# EAGLE design clock (EAGLE 9.6.2)
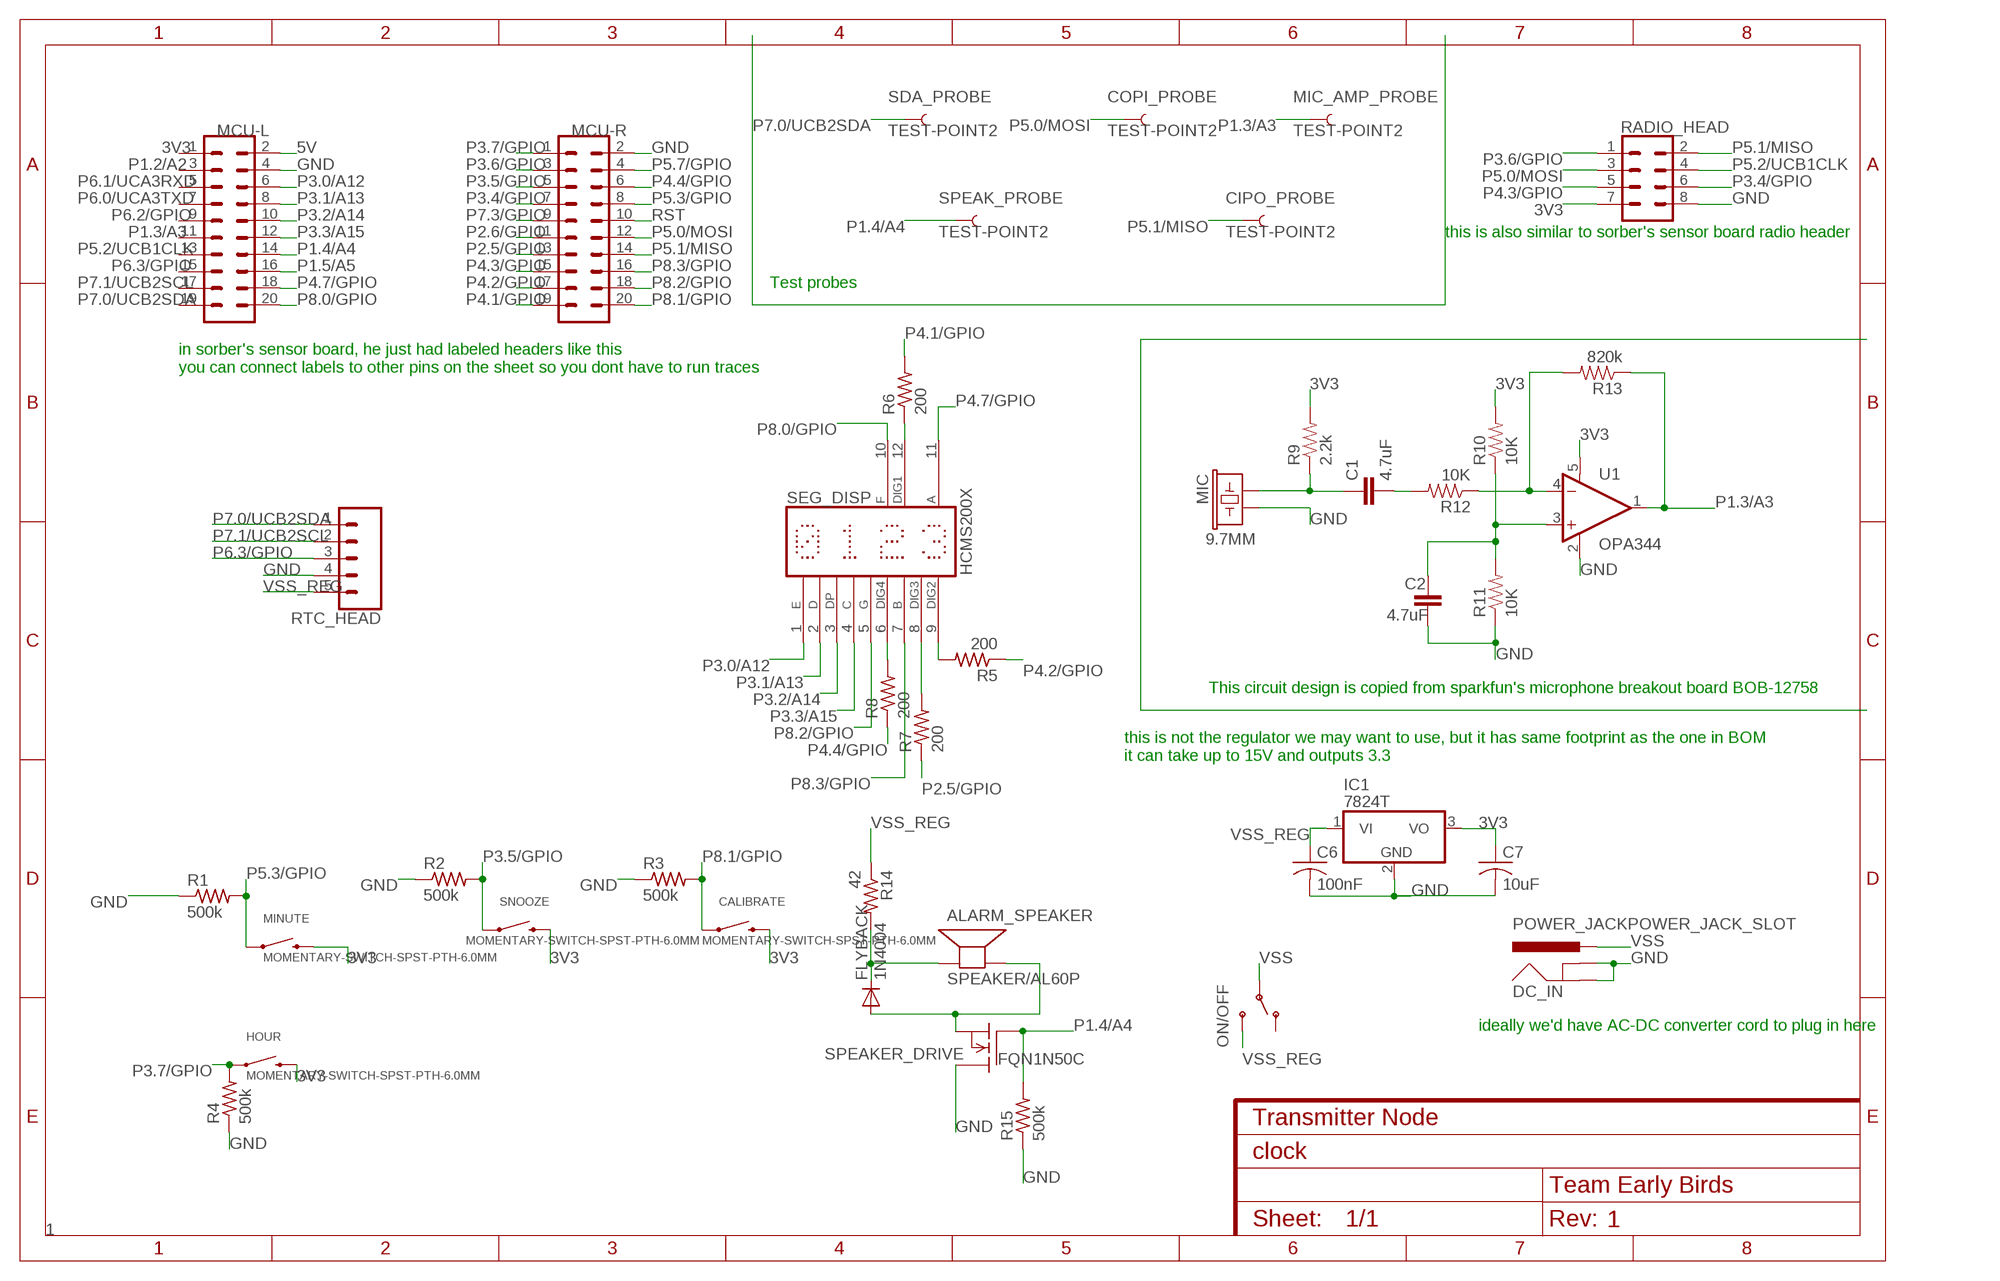
[diagram p0: schematic, sheet 1]
FRAME1 (FRAME-A4L): CNAME: Transmitter Node; CREVISION: 1; DESIGNER: Team Early Birds; REV: 1

## Parts
ALARM_SPEAKER  SPEAKER/AL60P  [AL60P]
C1  4.7uF  4.7UF-6.3V-10%(0603)0603  [0603-CAP]
C2  4.7uF  4.7UF-6.3V-10%(0603)0603  [0603-CAP]
C6  100nF  C-USC0805  [C0805]
C7  10uF  C-USC0805  [C0805]
CALIBRATE  MOMENTARY-SWITCH-SPST-PTH-6.0MM  [TACTILE_SWITCH_PTH_6.0MM]
CIPO_PROBE  TEST-POINT2  [PAD.02X.02]
COPI_PROBE  TEST-POINT2  [PAD.02X.02]
DC_IN  POWER_JACKPOWER_JACK_SLOT  [POWER_JACK_PTH_SLOT]
FLYBACK  1N4004  [DO41-10]
HOUR  MOMENTARY-SWITCH-SPST-PTH-6.0MM  [TACTILE_SWITCH_PTH_6.0MM]
IC1  7824T  [TO220H]
MCU-L  CONN_10X2  [2X10]
MCU-R  CONN_10X2  [2X10]
MIC  9.7MM  MIC9.7MM  [MIC-9.7MM]
MIC_AMP_PROBE  TEST-POINT2  [PAD.02X.02]
MINUTE  MOMENTARY-SWITCH-SPST-PTH-6.0MM  [TACTILE_SWITCH_PTH_6.0MM]
ON/OFF  SWITCH-SPDTSMD  [SWITCH_SPDT_SMD]
R1  500k  R-US_0204/5  [0204/5]
R2  500k  R-US_0204/5  [0204/5]
R3  500k  R-US_0204/5  [0204/5]
R4  500k  R-US_0204/5  [0204/5]
R5  200  R-US_0204/7  [0204/7]
R6  200  R-US_0204/7  [0204/7]
R7  200  R-US_0204/7  [0204/7]
R8  200  R-US_0204/7  [0204/7]
R9  2.2k  2.2KOHM-1/10W-1%(0603)  [0603-RES]
R10  10K  10KOHM-1/10W-1%(0603)0603  [0603-RES]
R11  10K  10KOHM-1/10W-1%(0603)0603  [0603-RES]
R12  10K  10KOHM-1/10W-1%(0603)0603  [0603-RES]
R13  820k  820KOHM-1/10W-1%(0603)  [0603-RES]
R14  42  R-US_0204/7  [0204/7]
R15  500k  R-US_0204/7  [0204/7]
RADIO_HEAD  CONN_04X2  [2X4]
RTC_HEAD  CONN_05LOCK  [1X05_LOCK]
SDA_PROBE  TEST-POINT2  [PAD.02X.02]
SEG_DISP  HCMS200X  [HCMS200X]
SNOOZE  MOMENTARY-SWITCH-SPST-PTH-6.0MM  [TACTILE_SWITCH_PTH_6.0MM]
SPEAK_PROBE  TEST-POINT2  [PAD.02X.02]
SPEAKER_DRIVE  FQN1N50C  [TO92]
U1  OPA344  [SOT23-5]

## Nets
3V3: C7.1 CALIBRATE.3 HOUR.3 IC1.3(VO) MCU-L.1 MINUTE.3 R9.2 R10.2 RADIO_HEAD.7 SNOOZE.3 U1.5(V+)
5V: MCU-L.2
GND: C2.2 C6.2 C7.2 DC_IN.GND DC_IN.GNDBREAK IC1.2(GND) MCU-L.4 MCU-R.2 MIC.2 R1.1 R2.1 R3.1 R4.1 R11.1 R15.1 RADIO_HEAD.8 RTC_HEAD.4 SPEAKER_DRIVE.2(D) U1.2(V-)
MIC_TEST: C1.1 MIC.1 R9.1
N$1: R8.2 SEG_DISP.6(I-CO)
N$3: R7.2 SEG_DISP.8(VB)
N$4: R5.2 SEG_DISP.9(VDD)
N$5: R6.1 SEG_DISP.12(IN)
N$6: R12.1 R13.2 U1.4(-IN)
N$7: C1.2 R12.2
N$8: C2.1 R10.1 R11.2 U1.3(+IN)
N$10: ALARM_SPEAKER.2(-) FLYBACK.A SPEAKER_DRIVE.3(S)
N$11: ALARM_SPEAKER.1(+) FLYBACK.C R14.2
P1.2/A2: MCU-L.3
P1.3/A3: MCU-L.11 MIC_AMP_PROBE.1 R13.1 U1.1(OUT)
P1.4/A4: MCU-L.14 R15.2 SPEAK_PROBE.1 SPEAKER_DRIVE.1(G)
P1.5/A5: MCU-L.16
P2.5/GPIO: MCU-R.13 R7.1
P2.6/GPIO: MCU-R.11
P3.0/A12: MCU-L.6 SEG_DISP.1(COL1)
P3.1/A13: MCU-L.8 SEG_DISP.2(COL2)
P3.2/A14: MCU-L.10 SEG_DISP.3(COL3)
P3.3/A15: MCU-L.12 SEG_DISP.4(COL4)
P3.4/GPIO: MCU-R.7 RADIO_HEAD.6
P3.5/GPIO: MCU-R.5 R2.2 SNOOZE.1
P3.6/GPIO: MCU-R.3 RADIO_HEAD.1
P3.7/GPIO: HOUR.1 MCU-R.1 R4.2
P4.1/GPIO: MCU-R.19 R6.2
P4.2/GPIO: MCU-R.17 R5.1
P4.3/GPIO: MCU-R.15 RADIO_HEAD.5
P4.4/GPIO: MCU-R.6 R8.1
P4.7/GPIO: MCU-L.18 SEG_DISP.11(GND)
P5.0/MOSI: COPI_PROBE.1 MCU-R.12 RADIO_HEAD.3
P5.1/MISO: CIPO_PROBE.1 MCU-R.14 RADIO_HEAD.2
P5.2/UCB1CLK: MCU-L.13 RADIO_HEAD.4
P5.3/GPIO: MCU-R.8 MINUTE.1 R1.2
P5.7/GPIO: MCU-R.4
P6.0/UCA3TXD: MCU-L.7
P6.1/UCA3RXD: MCU-L.5
P6.2/GPIO: MCU-L.9
P6.3/GPIO: MCU-L.15 RTC_HEAD.3
P7.0/UCB2SDA: MCU-L.19 RTC_HEAD.1 SDA_PROBE.1
P7.1/UCB2SCL: MCU-L.17 RTC_HEAD.2
P7.3/GPIO: MCU-R.9
P8.0/GPIO: MCU-L.20 SEG_DISP.10(CLK)
P8.1/GPIO: CALIBRATE.1 MCU-R.20 R3.2
P8.2/GPIO: MCU-R.18 SEG_DISP.5(COL5)
P8.3/GPIO: MCU-R.16 SEG_DISP.7(OUT)
RST: MCU-R.10
VSS: DC_IN.PWR ON/OFF.2(P)
VSS_REG: C6.1 IC1.1(VI) ON/OFF.3(S) R14.1 RTC_HEAD.5
Unconnected: ON/OFF.1(O)

## Notes on the sheet
- this is also similar to sorber's sensor board radio header
- Test probes
- in sorber's sensor board, he just had labeled headers like this
  you can connect labels to other pins on the sheet so you dont have to run traces
- This circuit design is copied from sparkfun's microphone breakout board BOB-12758
- this is not the regulator we may want to use, but it has same footprint as the one in BOM
  it can take up to 15V and outputs 3.3
- ideally we'd have AC-DC converter cord to plug in here

## Library data of the parts
ALARM_SPEAKER = adafruit:SPEAKER: SPEAKER Source: Buerklin Added PS12 (for part # PS1240 piezo) http://www.ladyada.net/library/pcb/eaglelibrary.html
C1 C2 = SparkFun-Capacitors:4.7UF-6.3V-10%(0603): CAP-08280; PROD_ID: CAP-08280
C6 C7 = adafruit:C-US: CAPACITOR, American symbol
CALIBRATE HOUR MINUTE SNOOZE = SparkFun-Switches:MOMENTARY-SWITCH-SPST: Momentary Switch (Pushbutton) - SPST Normally-open (NO) SPST momentary switches (buttons, pushbuttons). Variants PTH-12MM - 12mm square, through-hole Momentary Pushbutton Switch - 12mm Square <https://www.sparkfun.com/products/9190> (COM-09190) PTH-6.0MM, PTH-6.0MM-KIT - 6.0mm square, through-hole Mini Pushbutton Switch <https://www.sparkfun.com/products/97> (COM-00097) KIT package intended for soldering kit's - only one side of pads' copper is exposed. PTH-RIGHT-ANGLE-KIT - Right-angle, through-hole Right Angle Tactile Button <https://www.sparkfun.com/products/10791> - Used on SparkFun BigTime Watch Kit <https://www.sparkfun.com/products/11734> SMD-12MM - 12mm square, surface-mount Tactile Button - SMD (12mm) <https://www.sparkfun.com/products/12993> (COM-12993) Used on SparkFun PicoBoard <https://www.sparkfun.com/products/11888> SMD-4.5MM - 4.5mm Square Trackball Switch Used on SparkFun Blackberry Trackballer Breakout <https://www.sparkfun.com/products/13169> SMD-4.6MMX2.8MM - 4.60mm x 2.80mm, surface mount Used on SparkFun SAMD21 Mini Breakout <https://www.sparkfun.com/products/13664> SMD-5.2MM, SMD-5.2-REDUNDANT - 5.2mm square, surface-mount Mini Pushbutton Switch - SMD <https://www.sparkfun.com/products/8720> (COM-08720) Used on Arduino Pro Mini <https://www.sparkfun.com/products/11114> REDUNDANT package connects both switch circuits together SMD-6.0X3.5MM - 6.0 x 3.5mm, surface mount Momentary Reset Switch SMD <https://www.sparkfun.com/products/8229> (COM-08229) SMD-6.2MM-TALL - 6.2mm square, surface mount Tactile Button - SMD (6mm) <https://www.sparkfun.com/products/12992> Used on SparkFun Digital Sandbox <https://www.sparkfun.com/products/12651> SMD-RIGHT-ANGLE - Right-angle, surface mount Used on SparkFun Block for Intel® Edison - Arduino <https://www.sparkfun.com/products/13036>; PROD_ID: SWCH-08441; SF_SKU: COM-00097
CIPO_PROBE COPI_PROBE MIC_AMP_PROBE SDA_PROBE SPEAK_PROBE = SparkFun-Connectors:TEST-POINT: SparkFun Test Points Bare copper test points for troubleshooting or In-Circuit-Testing. These are used by our Production team for verifying production board runs using pogo-pins on test beds. SparkFun Products: SparkFun LSM9DS1 Breakout <https://www.sparkfun.com/products/13284> SparkFun PSOC <https://www.sparkfun.com/products/13714> SparkFun Load Cell Amplifier <https://www.sparkfun.com/products/13879>
DC_IN = SparkFun-Connectors:POWER_JACK: Power Jack Connector This is the standard 5.5mm barrel jack for power. The PTH is the most common, proven, reliable, footprint. The Slot footprint only works if the mill layer is transmitted to the PCB fab house so be warned. Here are the connectors we sell at SparkFun: DC Barrel Power Jack/Connector <https://www.sparkfun.com/products/119> (PRT-00119) DC Barrel Power Jack/Connector (SMD) <https://www.sparkfun.com/products/12748> (PRT-12748) DC Barrel Jack Adapter - Breadboard Compatible <https://www.sparkfun.com/products/10811> (PRT-10811) It is used on this SparkFun product (and many, many others): SparkFun RedBoard - Programmed with Arduino <https://www.sparkfun.com/products/12757> (DEV-12757) Also, if you need a mating power supply or connector, please check these out: Wall Adapter Power Supply - 9VDC 650mA <https://www.sparkfun.com/products/298> (TOL-00298) DC Barrel Jack Adapter - Male <https://www.sparkfun.com/products/10287> (PRT-10287); PROD_ID: CONN-08197
FLYBACK = adafruit:1N4004: DIODE General purpose 1N400x type rectifier (With bigger pads) http://www.ladyada.net/library/pcb/eaglelibrary.html
IC1 = adafruit:78*: Positive VOLTAGE REGULATOR Added bigger pads to the TO-92 package
MCU-L MCU-R = SparkFun-Connectors:CONN_10X2: Multi connection point. Often used as Generic Header-pin footprint for 0.1 inch spaced/style header connections On any of the 0.1 inch spaced packages, you can populate with these: Break Away Headers - Straight <https://www.sparkfun.com/products/116> (PRT-00116) Break Away Male Headers - Right Angle <https://www.sparkfun.com/products/553> (PRT-00553) Female Headers <https://www.sparkfun.com/products/115> (PRT-00115) Break Away Headers - Machine Pin <https://www.sparkfun.com/products/117> (PRT-00117) Break Away Female Headers - Swiss Machine Pin <https://www.sparkfun.com/products/743> (PRT-00743) Special note about the "SPECIAL" package: This was SPECIALLY designed to be used with our Graphic LCD Backpack. Be sure you want to use this! It is not only staggered on each line of header holes, but IT IS ALSO offset of the center point of the top and bottom lines by 5 mil. This causes the headers to lock into place on the "standard" footprint on the LCD screen. The extra squares on the tdocu layer are there simply to reference other pins (if you were to actually populate a longer header than ten long - this is what we do with the backpacks).
MIC = SparkFun-Sensors:MIC: Omni-directional electret microphone. 9.7mm standard diameter.; PROD_ID: COMP-08856
ON/OFF = SparkFun-Retired:SWITCH-SPDT: SPDT Switch Simple slide switch, Spark Fun Electronics SKU : COM-00102 DPDT SMT slide switch, AYZ0202, SWCH-08179
R1-R8 R14 R15 = adafruit:R-US_: RESISTOR, American symbol
R9 = SparkFun-Resistors:2.2KOHM-1/10W-1%(0603): RES-08272; PROD_ID: RES-08272
R10-R12 = SparkFun-Resistors:10KOHM-1/10W-1%(0603): RES-00824; PROD_ID: RES-00824
R13 = SparkFun-Resistors:820KOHM-1/10W-1%(0603); PROD_ID: RES-13247
RADIO_HEAD = SparkFun-Connectors:CONN_04X2: Multi connection point. Often used as Generic Header-pin footprint for 0.1 inch spaced/style header connections On any of the 0.1 inch spaced packages, you can populate with these: Break Away Headers - Straight <https://www.sparkfun.com/products/116> (PRT-00116) Break Away Male Headers - Right Angle <https://www.sparkfun.com/products/553> (PRT-00553) Female Headers <https://www.sparkfun.com/products/115> (PRT-00115) Break Away Headers - Machine Pin <https://www.sparkfun.com/products/117> (PRT-00117) Break Away Female Headers - Swiss Machine Pin <https://www.sparkfun.com/products/743> (PRT-00743)
RTC_HEAD = SparkFun-Connectors:CONN_05: Multi connection point. Often used as Generic Header-pin footprint for 0.1 inch spaced/style header connections On any of the 0.1 inch spaced packages, you can populate with these: Break Away Headers - Straight <https://www.sparkfun.com/products/116> (PRT-00116) Break Away Male Headers - Right Angle <https://www.sparkfun.com/products/553> (PRT-00553) Female Headers <https://www.sparkfun.com/products/115> (PRT-00115) Break Away Headers - Machine Pin <https://www.sparkfun.com/products/117> (PRT-00117) Break Away Female Headers - Swiss Machine Pin <https://www.sparkfun.com/products/743> (PRT-00743) For SCREWTERMINALS and SPRING TERMINALS visit here: Screw Terimnals on SparkFun.com <https://www.sparkfun.com/search/results?term=Screw+Terminals> (5mm/3.5mm/2.54mm spacing) This device is also useful as a general connection point to wire up your design to another part of your project. Our various solder wires solder well into these plated through hole pads. Hook-Up Wire - Assortment (Stranded, 22 AWG) <https://www.sparkfun.com/products/11375> (PRT-11375) Hook-Up Wire - Assortment (Solid Core, 22 AWG) <https://www.sparkfun.com/products/11367> (PRT-11367) View the entire wire category on our website here <https://www.sparkfun.com/categories/141> Special notes: Molex polarized connector foot print use with SKU : PRT-08231 with associated crimp pins and housings. 1MM SMD Version SKU: PRT-10208
SEG_DISP = 7-seg-custom:HCMS200X: LED DISPLAY 4-character dot matrix; OC_FARNELL: unknown; OC_NEWARK: unknown
SPEAKER_DRIVE = adafruit:FQN1N50C: N-Channel Enhancement MOSFET 500V, 0.4A, 6.0 Ohm
U1 = SparkFun-AnalogIC:OPA344: Single gate rail-to-rail output op-amp. Inputs extend 300mV past rails.; PROD_ID: IC-08251

## Net classes
0 default: width 0.305 mm, clearance 0.127 mm

## Board
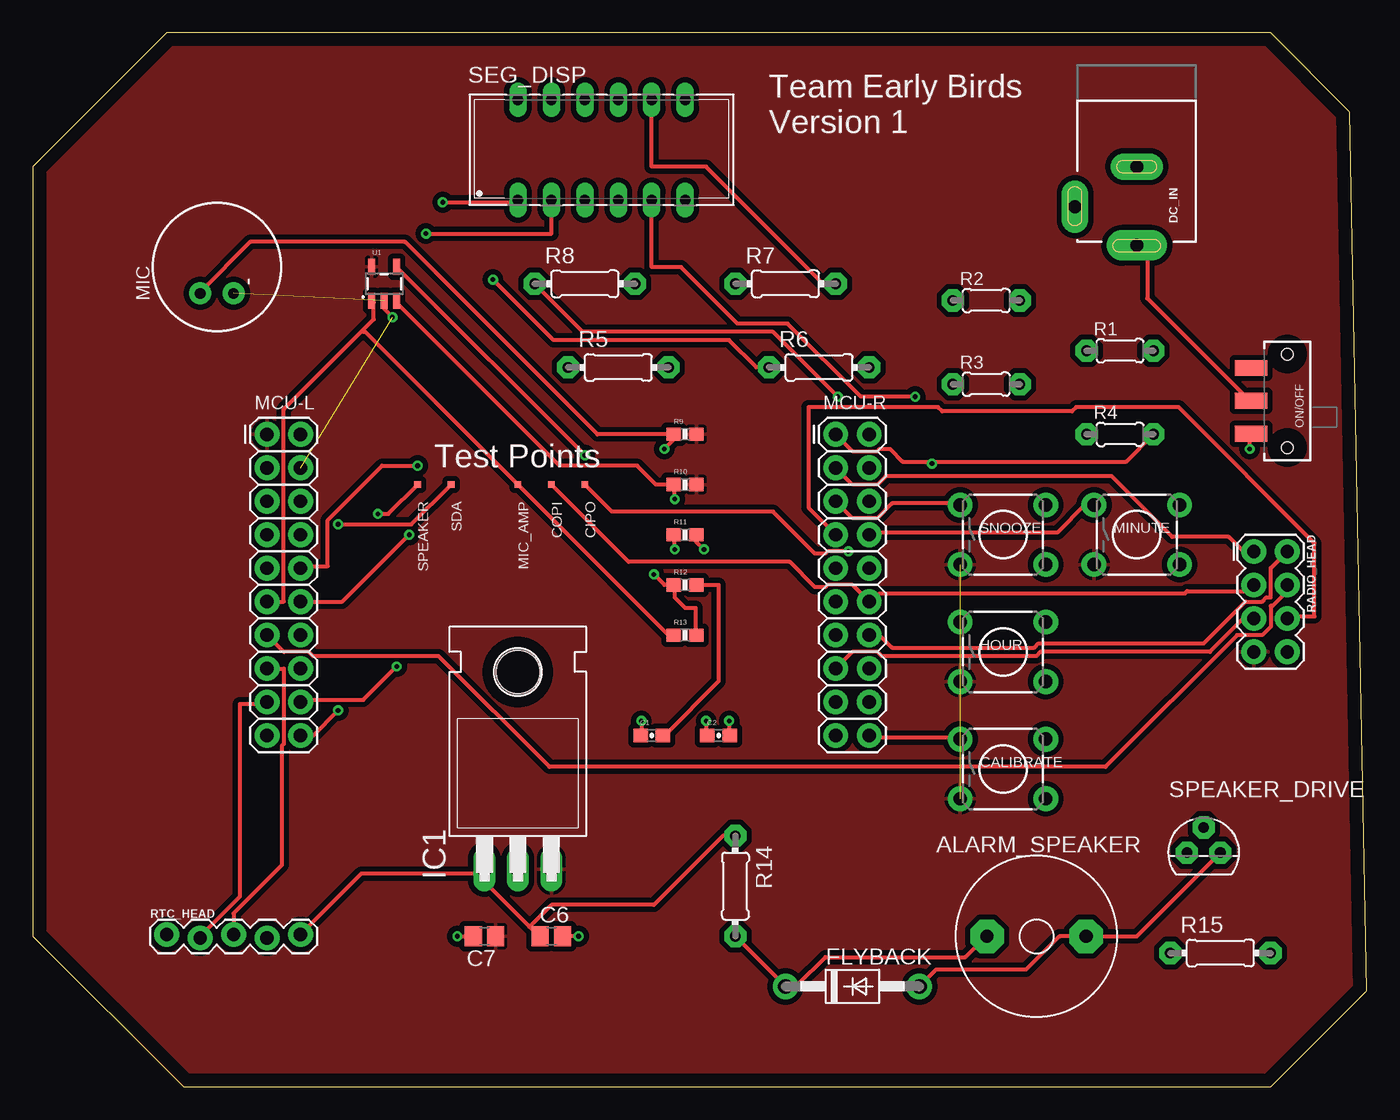
[diagram p1: board, top side]
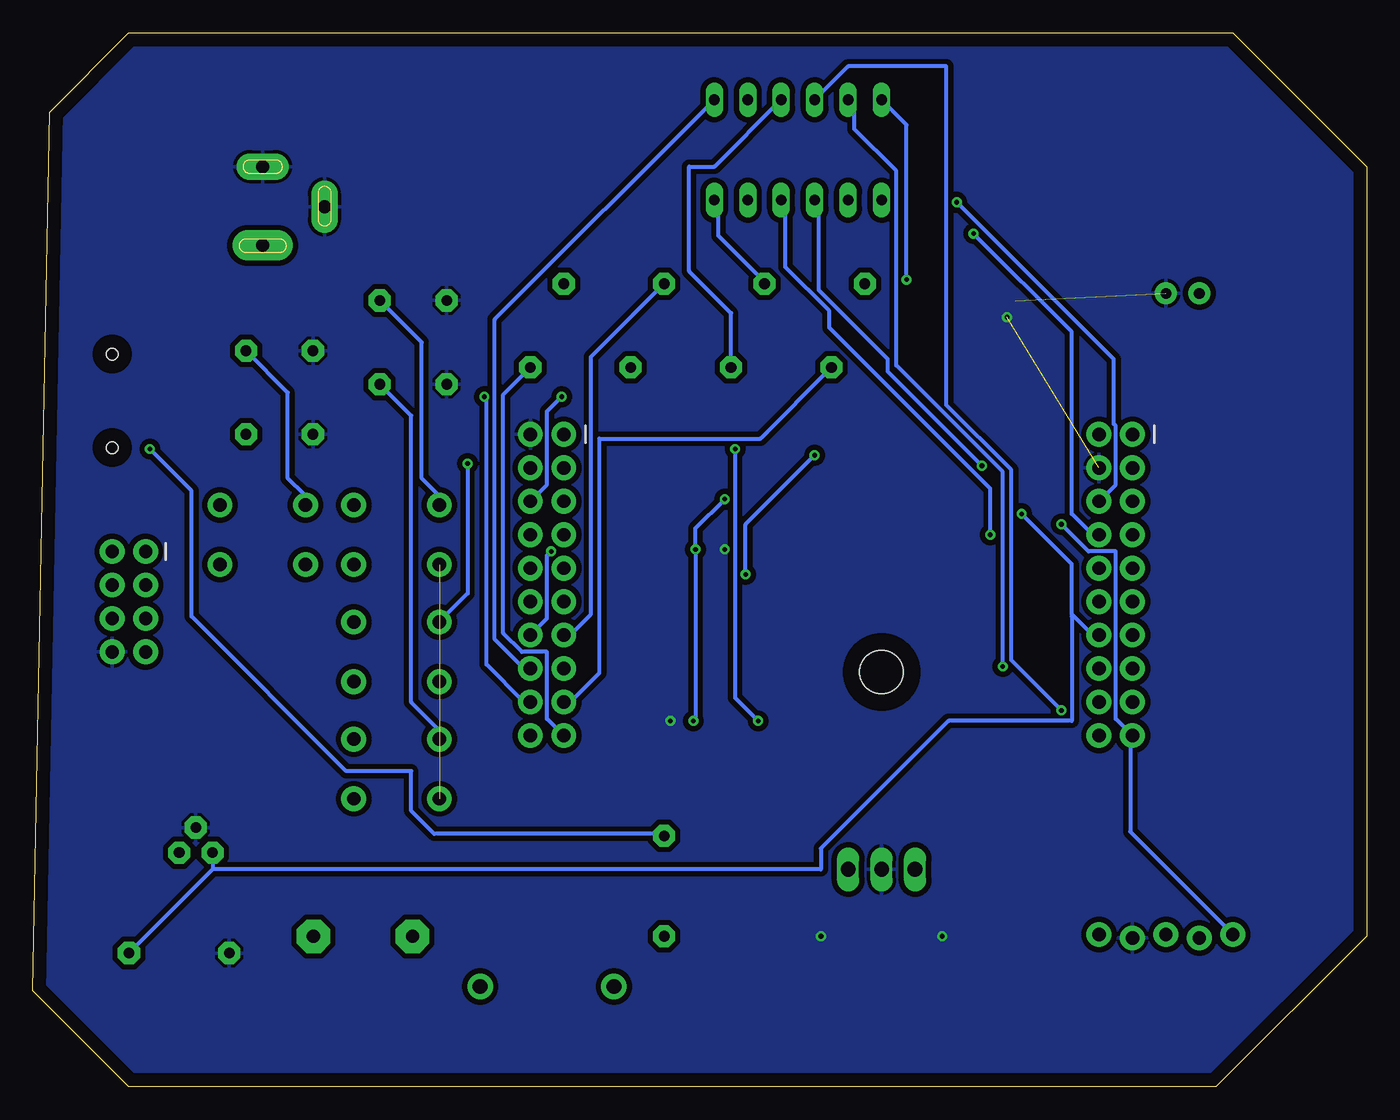
[diagram p2: board, bottom side, seen from below]

Size 101.27 x 80 mm. Coordinates in mm from the lower left corner, seen from the top.
Outline: 0,69.85 0,11.43 11.43,0 93.98,0 101.27,7.29 100,73.99 93.99,80 10.15,80 0,69.85
Copper layers (1*16): Top 0.035mm / dielectric 1.5mm / Bottom 0.035mm
Design rules "default *": minimum track width 6mil, minimum drill 0.35mm, track to track 8mil, track to pad 6mil, pad to pad 6mil, via to via 6mil, smd to smd 6mil, copper to edge 40mil, drill to drill 6mil, minimum pad ring 10mil, minimum via ring 8mil, stop-mask expansion 4mil, vias tented up to drill 0mil, thermal gap 10mil

### Footprints (pad centres in the part's own frame; a part is rotated, then mirrored left to right if it is on the bottom)
AL60P = drill 1.016 pad 2.54 octagon: 1 -3.759,0; 2 3.759,0
0603-CAP = smd 1.1 x 1: 1 -0.85,0; 2 0.85,0
C0805 = smd 1.3 x 1.5: 1 -0.85,0; 2 0.85,0
TACTILE_SWITCH_PTH_6.0MM = drill 1.016 pad 1.88: 1 -3.251,2.261; 2 3.251,2.261; 3 -3.251,-2.261; 4 3.251,-2.261
PAD.02X.02 = smd 0.508 x 0.508: 1 0,0
POWER_JACK_PTH_SLOT = drill 1 pad 2 long: GND 0,0; GNDBREAK -3.048,4.699 | drill 1 pad 2.3 long: PWR -5.969,0
DO41-10 = drill 1.118 pad 1.93: A 5.08,0; C -5.08,0
TO220H = drill 1.118 long: 1 -2.54,-10.16; 2 0,-10.16; 3 2.54,-10.16 | hole 3.302: 0,4.826
2X10 = drill 1.016 pad 1.88: 1 0,0; 2 0,2.54; 3 2.54,0; 4 2.54,2.54; 5 5.08,0; 6 5.08,2.54; 7 7.62,0; 8 7.62,2.54; 9 10.16,0; 10 10.16,2.54; 11 12.7,0; 12 12.7,2.54; 13 15.24,0; 14 15.24,2.54; 15 17.78,0; 16 17.78,2.54; 17 20.32,0; 18 20.32,2.54; 19 22.86,0; 20 22.86,2.54
MIC-9.7MM = drill 0.8 pad 1.676: 1 -2,1.27; 2 -2,-1.27
SWITCH_SPDT_SMD = smd 1.2 x 2.5: 1 -2.5,-2.75; 2 0,-2.75; 3 2.5,-2.75 | hole 0.9: -3.55,0; 3.55,0
0204/5 = drill 0.813 pad 1.676 octagon: 1 -2.54,0; 2 2.54,0
0204/7 = drill 0.813 pad 1.676 octagon: 1 -3.81,0; 2 3.81,0
0603-RES = smd 1.1 x 1: 1 -0.85,0; 2 0.85,0
2X4 = drill 1.016 pad 1.88: 1 -3.81,-1.27; 2 -3.81,1.27; 3 -1.27,-1.27; 4 -1.27,1.27; 5 1.27,-1.27; 6 1.27,1.27; 7 3.81,-1.27; 8 3.81,1.27
1X05_LOCK = drill 1.016 pad 1.88: 1 0,0.127; 2 2.54,-0.127; 3 5.08,0.127; 4 7.62,-0.127; 5 10.16,0.127
HCMS200X = drill 0.813 long: 1 -6.35,-3.81; 2 -3.81,-3.81; 3 -1.27,-3.81; 4 1.27,-3.81; 5 3.81,-3.81; 6 6.35,-3.81; 7 6.35,3.81; 8 3.81,3.81; 9 1.27,3.81; 10 -1.27,3.81; 11 -3.81,3.81; 12 -6.35,3.81
TO92 = drill 0.813 pad 1.676 octagon: 1 -1.27,0; 2 0,1.905; 3 1.27,0
SOT23-5 = smd 0.55 x 1.2: 1 -0.95,-1.3; 2 0,-1.3; 3 0.95,-1.3; 4 0.95,1.3; 5 -0.95,1.3

### Placement (x,y rotation side)
ALARM_SPEAKER  76.2,11.43 0 top
C1  46.99,26.67 0 top
C2  52.07,26.67 0 top
C6  39.37,11.43 0 top
C7  34.29,11.43 180 top
CALIBRATE  73.66,24.13 0 top
CIPO_PROBE  41.91,45.72 0 top
COPI_PROBE  39.37,45.72 0 top
DC_IN  83.82,69.85 90 top
FLYBACK  62.23,7.62 0 top
HOUR  73.66,33.02 0 top
IC1  36.83,26.67 0 top
MCU-L  17.78,49.53 270 top
MCU-R  60.96,49.53 270 top
MIC  13.97,62.23 90 top
MIC_AMP_PROBE  36.83,45.72 0 top
MINUTE  83.82,41.91 0 top
ON/OFF  95.25,52.07 270 top
R1  82.55,55.88 0 top
R2  72.39,59.69 0 top
R3  72.39,53.34 0 top
R4  82.55,49.53 0 top
R5  44.45,54.61 0 top
R6  59.69,54.61 0 top
R7  57.15,60.96 0 top
R8  41.91,60.96 0 top
R9  49.53,49.53 0 top
R10  49.53,45.72 0 top
R11  49.53,41.91 0 top
R12  49.53,38.1 0 top
R13  49.53,34.29 0 top
R14  53.34,15.24 270 top
R15  90.17,10.16 0 top
RADIO_HEAD  93.98,36.83 270 top
RTC_HEAD  10.16,11.43 0 top
SDA_PROBE  31.75,45.72 0 top
SEG_DISP  43.18,71.12 0 top
SNOOZE  73.66,41.91 0 top
SPEAK_PROBE  29.21,45.72 0 top
SPEAKER_DRIVE  88.9,17.78 0 top
U1  26.67,60.96 0 top

### Tracks (layer width: path | path; a pad name or v marks a point on that pad's centre or on a via)
3V3  (2 unrouted)
  pour Top (isolate 0.406): -5.08,81.28 107.95,81.28 107.95,-5.08 -5.08,-5.08
GND  (via drill 0.35)  (2 unrouted)
  Top 0.305: v52.86,27.78 52.86,26.67 C2.2 | v48.74,40.8 48.74,41.91 R11.1 | U1.2 26.67,59.05 v27.3,58.42 | v32.23,11.43 C7.2 | v41.43,11.43 C6.2
  pour Bottom (isolate 0.406): -5.08,81.28 107.95,81.28 107.95,-5.08 -5.08,-5.08
MIC_TEST  (via drill 0.35)
  Top 0.305: v46.2,27.78 46.2,26.67 C1.1 | v47.94,48.42 48.58,49.05 48.58,49.53 | 48.58,49.53 42.86,49.53 28.26,64.14 16.51,64.14 12.7,60.33 MIC.1 | 48.58,49.53 R9.1
  Bottom 0.305: v46.2,27.78 47.94,29.53 v47.94,48.42
N$1
  Bottom 0.305: SEG_DISP.6 49.21,66.99 49.21,64.61 45.72,61.12 R8.2
N$3
  Top 0.305: SEG_DISP.8 46.99,69.85 51.12,69.85 60.01,60.96 R7.2
N$4
  Bottom 0.305: SEG_DISP.9 49.53,69.85 51.44,69.85 51.44,61.91 48.26,58.74 R5.2
N$5  (via drill 0.35)
  Top 0.305: v34.92,61.28 39.53,56.67 52.86,56.67 54.93,54.61 R6.1
  Bottom 0.305: SEG_DISP.12 34.92,73.03 v34.92,61.28
N$6  (via drill 0.35)
  Top 0.305: R13.2 50.32,34.29 50.32,36.35 49.53,36.35 48.74,37.15 48.74,38.1 R12.1 47.94,38.1 v47.15,38.89 | v41.91,47.94 27.62,62.23 U1.4
  Bottom 0.305: v41.91,47.94 47.15,42.7 v47.15,38.89
N$7
  Top 0.305: R12.2 52.07,38.1 52.07,30.8 47.94,26.67 C1.2
N$8  (via drill 0.35)
  Top 0.305: v51.12,27.78 51.12,26.67 C2.1 | v50.96,40.8 50.32,41.43 50.32,41.91 R11.2 | v48.74,44.61 48.74,45.72 R10.1 47.31,45.72 45.88,47.15 40.01,47.15 27.62,59.53 U1.3
  Bottom 0.305: v51.12,27.78 50.96,27.94 v50.96,40.8 50.96,42.39 v48.74,44.61
N$10
  Top 0.305: SPEAKER_DRIVE.3 83.82,11.43 ALARM_SPEAKER.2 77.95,11.43 75.41,8.89 68.58,8.89 FLYBACK.A
N$11
  Top 0.305: R14.2 FLYBACK.C 57.15,7.78 58.1,7.78 60.17,9.84 70.8,9.84 72.39,11.43 ALARM_SPEAKER.1
P1.3/A3
  Top 0.305: R13.1 48.26,34.29 MIC_AMP_PROBE.1 25.24,57.31 25.08,57.31 25,57.39 | 25,57.39 19.05,51.44 19.05,36.83 MCU-L.11 | 25,57.39 25.88,58.26 25.88,59.53 U1.1
P1.4/A4  (via drill 0.35)
  Top 0.305: SPEAK_PROBE.1 26.99,43.5 v26.19,43.5
  Bottom 0.305: 87.63,16.51 R15.2 | SPEAKER_DRIVE.1 87.63,16.51 | v26.19,43.5 22.38,39.69 22.38,35.88 22.3,35.8 | 22.3,35.8 20.8,34.29 MCU-L.14 | 87.63,16.51 41.43,16.51 41.43,18.1 31.75,27.78 22.38,27.78 22.38,35.72 22.3,35.8
P2.5/GPIO
  Bottom 0.305: R7.1 58.9,55.4 58.9,35.88 60.48,34.29 MCU-R.13
P3.0/A12  (via drill 0.35)
  Top 0.305: SEG_DISP.1 36.67,67.15 v31.11,67.15
  Bottom 0.305: v31.11,67.15 19.21,55.24 19.21,50.32 19.05,50.16 19.05,45.72 MCU-L.6
P3.1/A13  (via drill 0.35)
  Top 0.305: SEG_DISP.2 39.37,64.77 v29.84,64.77
  Bottom 0.305: v29.84,64.77 22.38,57.31 22.38,43.5 20.8,41.91 MCU-L.8
P3.2/A14  (via drill 0.35)
  Top 0.305: v29.21,47.15 26.51,47.15 22.38,43.02 22.38,39.53 20.48,39.53 MCU-L.10
  Bottom 0.305: SEG_DISP.3 41.59,66.99 41.59,60.48 36.35,55.24 36.35,54.29 v29.21,47.15
P3.3/A15  (via drill 0.35)
  Top 0.305: v28.57,41.91 23.5,36.83 MCU-L.12
  Bottom 0.305: SEG_DISP.4 44.13,66.99 44.13,62.23 40.8,58.9 40.8,57.63 28.57,45.4 v28.57,41.91
P3.4/GPIO
  Top 0.305: MCU-R.7 58.9,43.97 58.9,51.59 68.74,51.59 69.06,51.28 78.9,51.28 79.22,51.59 87,51.59 97.31,41.27 97.31,35.72 95.41,35.72 RADIO_HEAD.6
P3.5/GPIO
  Top 0.305: MCU-R.5 62.23,43.18 64.14,43.18 65.25,44.29 70.33,44.29 SNOOZE.1
  Bottom 0.305: R2.2 71.75,56.52 71.75,46.2 70.48,44.93 70.48,44.29 SNOOZE.1
P3.6/GPIO
  Top 0.305: MCU-R.3 62.23,45.72 64.14,45.72 64.77,46.35 81.92,46.35 86.52,41.75 90.81,41.75 91.92,40.64 RADIO_HEAD.1
P3.7/GPIO  (via drill 0.35)
  Top 0.305: R4.2 83.03,47.47 68.26,47.47 | 68.26,47.47 66.04,47.47 65.09,48.42 64.29,48.42 64.14,48.26 62.23,48.26 MCU-R.1 | 68.26,47.47 v68.26,47.31
  Bottom 0.305: v68.26,47.31 68.26,37.47 70.33,35.4 HOUR.1
P4.1/GPIO
  Bottom 0.305: R6.2 65.56,52.55 65.56,34.45 64.14,33.02 62.23,33.02 62.23,27.94 MCU-R.19
P4.2/GPIO
  Bottom 0.305: R5.1 46.04,49.21 58.26,49.21 58.26,31.43 60.48,29.21 MCU-R.17
P4.3/GPIO
  Top 0.305: MCU-R.15 62.23,33.02 64.14,33.02 64.45,32.7 76.2,32.7 76.52,33.02 89.38,33.02 91.92,35.56 RADIO_HEAD.5
P4.4/GPIO  (via drill 0.35)
  Top 0.305: R8.1 41.75,57.31 56.2,57.31 v61.12,52.39
  Bottom 0.305: v61.12,52.39 62.23,51.28 62.23,45.72 MCU-R.6
P4.7/GPIO  (via drill 0.35)
  Top 0.305: v27.62,31.91 25.08,29.37 20.48,29.37 MCU-L.18
  Bottom 0.305: SEG_DISP.11 38.89,74.45 38.89,72.71 35.72,69.53 35.72,54.77 27.62,46.67 v27.62,31.91
P5.0/MOSI
  Top 0.305: COPI_PROBE.1 45.24,39.85 57.47,39.85 59.37,37.94 60.17,37.94 60.33,38.1 62.23,38.1 MCU-R.12 63.5,36.99 63.82,36.99 64.29,37.47 87.47,37.47 87.63,37.62 92.23,37.62 RADIO_HEAD.3
P5.1/MISO  (via drill 0.35)
  Top 0.305: CIPO_PROBE.1 43.97,43.66 56.2,43.66 59.37,40.48 60.17,40.48 60.33,40.64 v61.91,40.64 | RADIO_HEAD.2 93.98,39.37 93.98,37.15 93.66,37.15 93.34,36.83 92.08,36.83 88.9,33.66 76.36,33.66 76.04,33.34 65.25,33.34 64.29,34.29 MCU-R.14
  Bottom 0.305: v61.91,40.64 62.23,40.32 62.23,35.56 MCU-R.14
P5.2/UCB1CLK
  Top 0.305: MCU-L.13 19.05,33.02 20.95,33.02 21.27,32.7 30.8,32.7 39.21,24.29 81.44,24.29 91.44,34.29 93.34,34.29 93.98,34.92 93.98,36.51 94.14,36.51 95.25,37.62 RADIO_HEAD.4
P5.3/GPIO
  Top 0.305: MCU-R.8 63.66,42.07 77.79,42.07 79.85,44.13 80.49,44.13 MINUTE.1
  Bottom 0.305: R1.2 81.92,52.7 81.92,46.2 80.64,44.93 80.64,44.29 MINUTE.1
P6.3/GPIO
  Top 0.305: RTC_HEAD.3 15.24,13.18 18.89,16.83 18.89,25.88 19.05,26.04 19.05,31.75 MCU-L.15
P7.0/UCB2SDA  (via drill 0.35)
  Top 0.305: SDA_PROBE.1 28.73,42.7 v23.18,42.7
  Bottom 0.305: v23.18,42.7 21.11,40.64 19.05,40.64 19.05,27.94 MCU-L.19 17.94,26.67 17.94,19.37 10.16,11.59 RTC_HEAD.1
P7.1/UCB2SCL
  Top 0.305: MCU-L.17 17.62,29.05 15.72,29.05 15.72,14.45 12.7,11.43 RTC_HEAD.2
P8.0/GPIO  (via drill 0.35)
  Top 0.305: v23.18,28.57 21.27,26.67 MCU-L.20
  Bottom 0.305: SEG_DISP.10 39.37,77.47 31.91,77.47 31.91,51.75 26.99,46.83 26.99,32.38 v23.18,28.57
P8.1/GPIO
  Top 0.305: MCU-R.20 63.66,26.51 70.33,26.51 CALIBRATE.1
  Bottom 0.305: R3.2 72.55,50.96 72.55,29.21 70.48,27.15 70.48,26.51 CALIBRATE.1
P8.2/GPIO  (via drill 0.35)
  Top 0.305: SEG_DISP.5 46.99,62.23 49.21,62.23 53.5,57.94 57.31,57.94 62.87,52.39 v66.99,52.39
  Bottom 0.305: v66.99,52.39 66.83,52.23 66.83,32.07 63.98,29.21 MCU-R.18
P8.3/GPIO
  Bottom 0.305: SEG_DISP.7 66.2,58.26 66.2,33.97 63.98,31.75 MCU-R.16
VSS
  Top 0.305: ON/OFF.2 92.39,52.07 84.61,59.85 84.61,63.82 83.82,63.82 DC_IN.PWR
VSS_REG  (via drill 0.35)
  Top 0.305: 37.7,12.14 34.29,15.56 34.29,16.19 | 37.7,12.14 38.42,11.43 C6.1 | 34.29,16.19 24.92,16.19 20.32,11.59 RTC_HEAD.5 | 34.29,16.19 IC1.1 | v92.39,48.42 92.39,49.53 ON/OFF.3 | 37.7,12.14 39.37,13.81 47.15,13.81 52.39,19.05 R14.1
  Bottom 0.305: v92.39,48.42 89.22,45.24 89.22,35.72 77.47,23.97 72.55,23.97 72.55,20.95 70.8,19.21 53.34,19.21 R14.1

### Text on the board
tNames: Team Early Birds / Version 1 | Test Points | SPEAKER | SDA | MIC_AMP | COPI | CIPO